# Altium project noname.PrjPcb
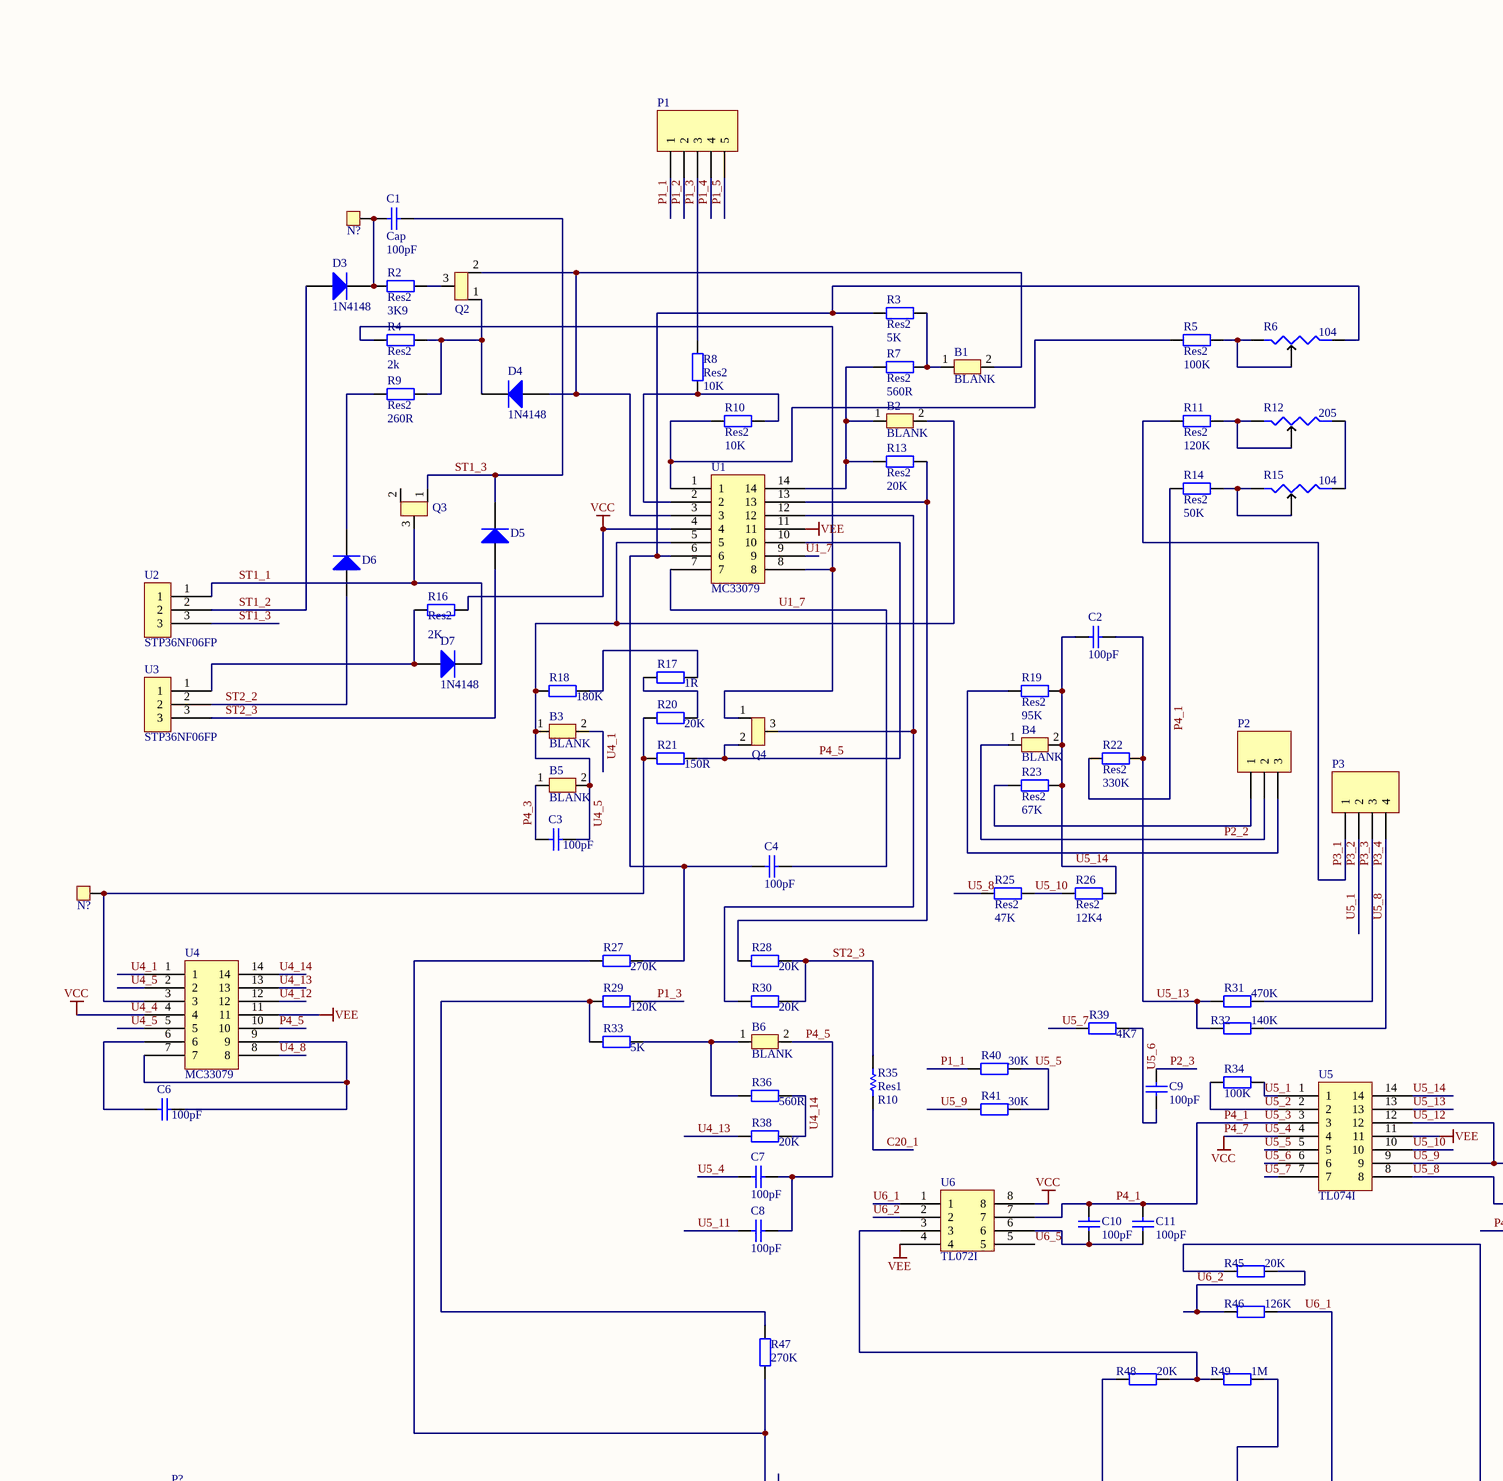
[diagram p0: noname.SchDoc, top left]
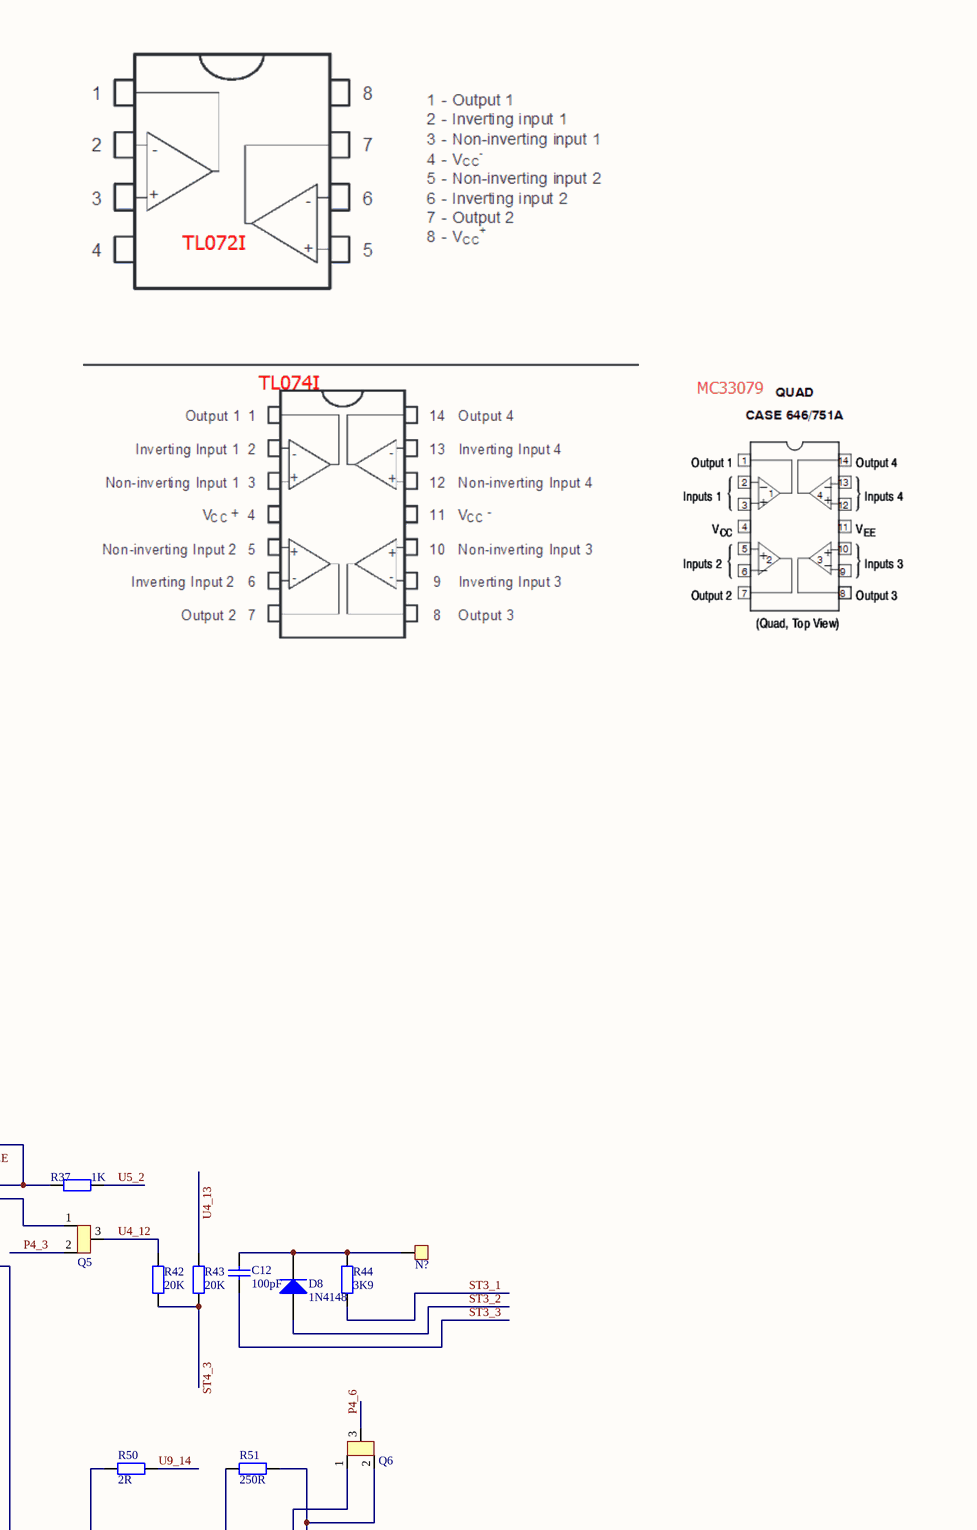
[diagram p1: noname.SchDoc, top right]
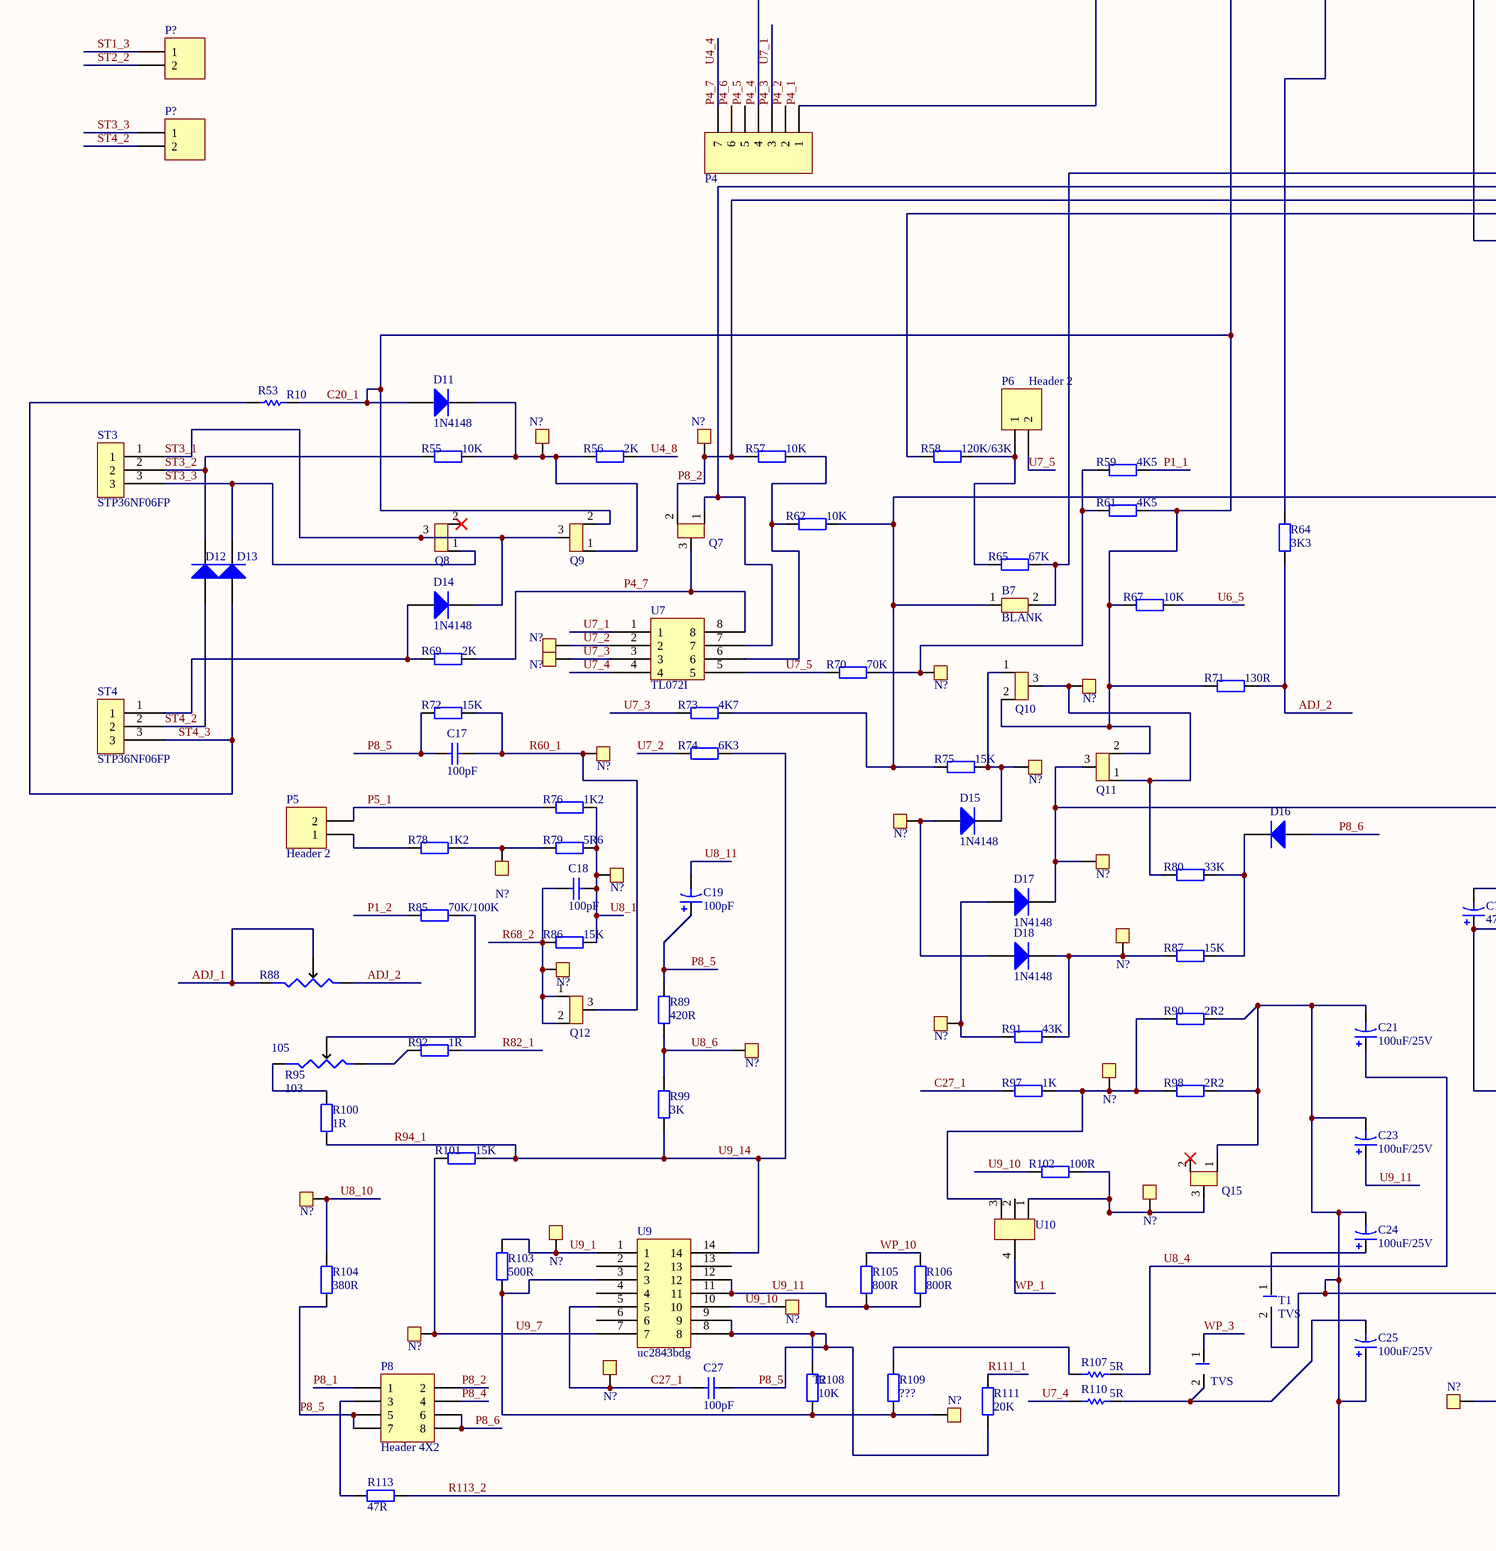
[diagram p2: noname.SchDoc, bottom left]
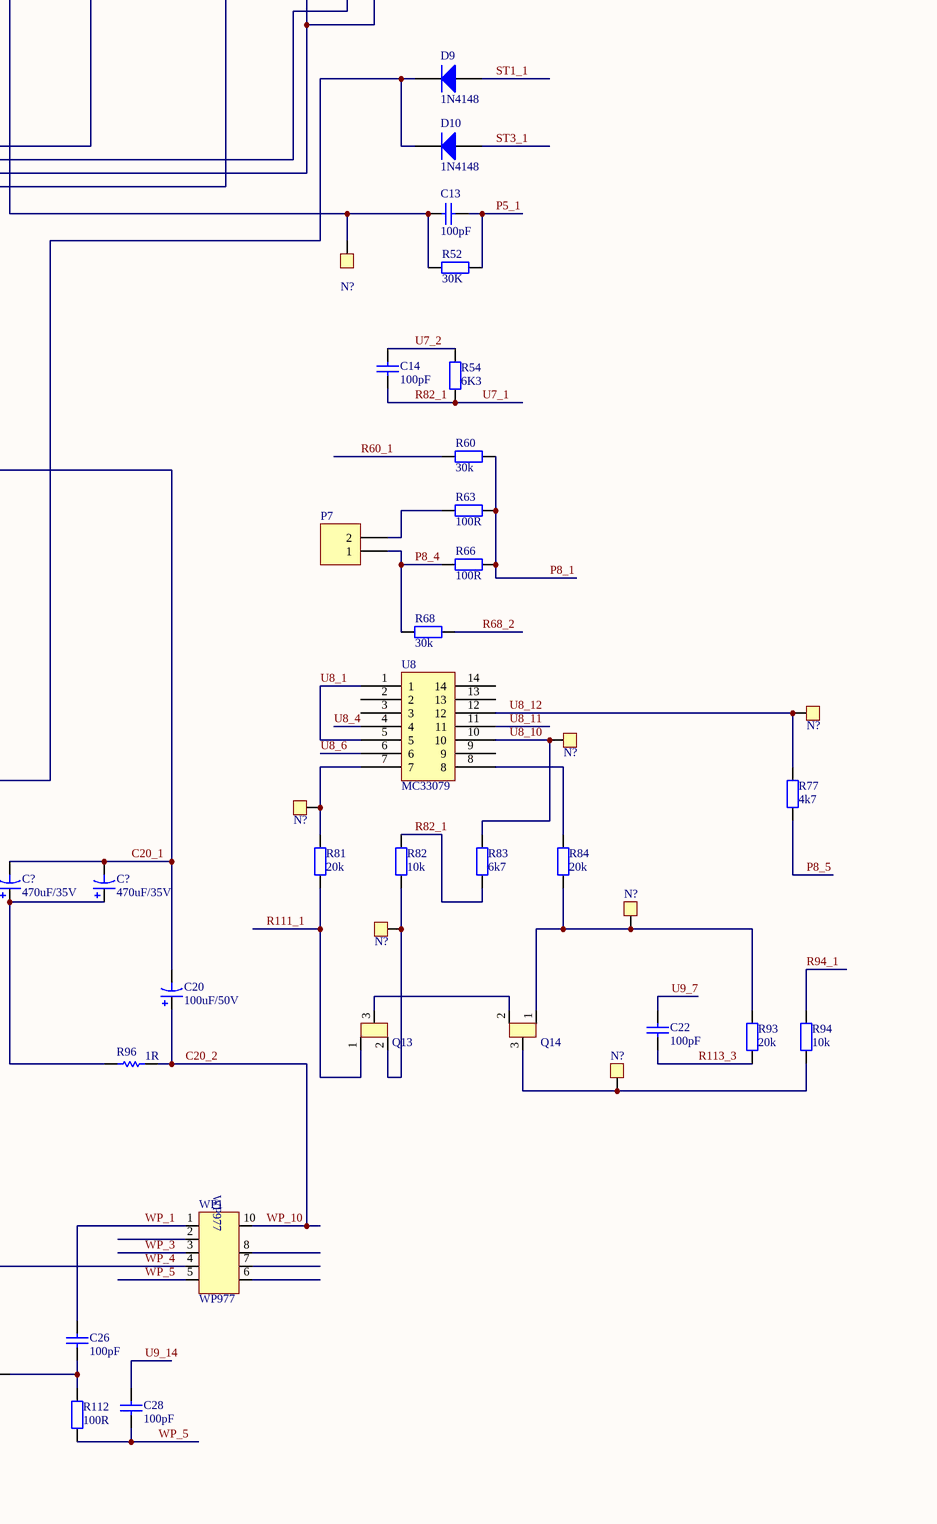
[diagram p3: noname.SchDoc, bottom right]
1 sheet, 235 parts. Net scope: global (net labels, ports and power ports of the same name join across sheets).
Board file: noname.PcbDoc

## Sheet noname.SchDoc
size A0

### Parts
(Parts that share a designator on the sheet are numbered #1, #2 ... from top to bottom, then left to right.)
B1  BLANK  [0805]
B2  BLANK  [0805]
B3  BLANK  [0805]
B4  BLANK  [0805]
B5  BLANK  [0805]
B6  BLANK  [0805]
B7  BLANK  [0805]
C1  Cap  value 100pF  [C0805]
C2  value 100pF  [C0805]  (hidden comment: Cap)
C3  value 100pF  [C0805]  (hidden comment: Cap)
C4  value 100pF  [C0805]  (hidden comment: Cap)
C6  value 100pF  [C0805]  (hidden comment: Cap)
C7  value 100pF  [C0805]  (hidden comment: Cap)
C8  value 100pF  [C0805]  (hidden comment: Cap)
C9  value 100pF  [C0805]  (hidden comment: Cap)
C10  value 100pF  [C0805]  (hidden comment: Cap)
C11  value 100pF  [C0805]  (hidden comment: Cap)
C12  value 100pF  [C0805]  (hidden comment: Cap)
C13  value 100pF  [C0805]  (hidden comment: Cap)
C14  value 100pF  [C0805]  (hidden comment: Cap)
C17  value 100pF  [C0805]  (hidden comment: Cap)
C18  value 100pF  [C0805]  (hidden comment: Cap)
C19  value 100pF  [RB7.6-15]  (hidden comment: Cap Pol1)
C20  value 100uF/50V  [RB7.6-15]  (hidden comment: Cap Pol1)
C21  value 100uF/25V  [RB7.6-15]  (hidden comment: Cap Pol1)
C22  value 100pF  [C0805]  (hidden comment: Cap)
C23  value 100uF/25V  [RB7.6-15]  (hidden comment: Cap Pol1)
C24  value 100uF/25V  [RB7.6-15]  (hidden comment: Cap Pol1)
C25  value 100uF/25V  [RB7.6-15]  (hidden comment: Cap Pol1)
C26  value 100pF  [C0805]  (hidden comment: Cap)
C27  value 100pF  [C0805]  (hidden comment: Cap)
C28  value 100pF  [C0805]  (hidden comment: Cap)
C?#1  value 470uF/35V  [RB7.6-15]  (hidden comment: Cap Pol1)
C?#2  value 470uF/35V  [RB7.6-15]  (hidden comment: Cap Pol1)
D3  1N4148  [0805]
D4  1N4148  [0805]
D5  Diode 1N4001  [DIO10.46-5.3x2.8]  (value not drawn)
D6  Diode 1N4001  [DIO10.46-5.3x2.8]  (value not drawn)
D7  1N4148  [0805]
D8  1N4148  [0805]
D9  1N4148  [0805]
D10  1N4148  [0805]
D11  1N4148  [0805]
D12  Diode 1N4001  [DIO10.46-5.3x2.8]  (value not drawn)
D13  Diode 1N4001  [DIO10.46-5.3x2.8]  (value not drawn)
D14  1N4148  [0805]
D15  1N4148  [0805]
D16  Diode 1N4001  [DIO10.46-5.3x2.8]  (value not drawn)
D17  1N4148  [0805]
D18  1N4148  [0805]
N?#1  Node  (value not drawn)
N?#2  Node  (value not drawn)
N?#3  Node  (value not drawn)
N?#4  Node  (value not drawn)
N?#5  Node  (value not drawn)
N?#6  Node  (value not drawn)
N?#7  Node  (value not drawn)
N?#8  Node  (value not drawn)
N?#9  Node  (value not drawn)
N?#10  Node  (value not drawn)
N?#11  Node  (value not drawn)
N?#12  Node  (value not drawn)
N?#13  Node  (value not drawn)
N?#14  Node  (value not drawn)
N?#15  Node  (value not drawn)
N?#16  Node  (value not drawn)
N?#17  Node  (value not drawn)
N?#18  Node  (value not drawn)
N?#19  Node  (value not drawn)
N?#20  Node  (value not drawn)
N?#21  Node  (value not drawn)
N?#22  Node  (value not drawn)
N?#23  Node  (value not drawn)
N?#24  Node  (value not drawn)
N?#25  Node  (value not drawn)
N?#26  Node  (value not drawn)
N?#27  Node  (value not drawn)
N?#28  Node  (value not drawn)
N?#29  Node  (value not drawn)
N?#30  Node  (value not drawn)
N?#31  Node  (value not drawn)
N?#32  Node  (value not drawn)
N?#33  Node  (value not drawn)
N?#34  Node  (value not drawn)
N?#35  Node  (value not drawn)
P1  Header 5  [HDR1X5]  (value not drawn)
P2  Header 3  [HDR1X3]  (value not drawn)
P3  Header 4  [HDR1X4]  (value not drawn)
P4  Header 7  [HDR1X7]  (value not drawn)
P5  Header 2  [HDR1X2]
P6  Header 2  [HDR1X2]
P7  Header 2  [HDR1X2]  (value not drawn)
P8  Header 4X2  [HDR2X4]
P?#1  Header 2  [HDR1X2]  (value not drawn)
P?#2  Header 2  [HDR1X2]  (value not drawn)
Q2  BC846B  (value not drawn)
Q3  BC846B  (value not drawn)
Q4  BC846B  (value not drawn)
Q5  BC846B  (value not drawn)
Q6  BC846B  (value not drawn)
Q7  BC846B  (value not drawn)
Q8  BC846B  (value not drawn)
Q9  BC846B  (value not drawn)
Q10  BC846B  (value not drawn)
Q11  BC846B  (value not drawn)
Q12  BC846B  (value not drawn)
Q13  BC846B  (value not drawn)
Q14  BC846B  (value not drawn)
Q15  BC846B  (value not drawn)
R2  Res2  value 3K9  [0805]
R3  Res2  value 5K  [0805]
R4  Res2  value 2k  [0805]
R5  Res2  value 100K  [0805]
R6  value 104  [VR3]  (hidden comment: Res Adj)
R7  Res2  value 560R  [0805]
R8  Res2  value 10K  [0805]
R9  Res2  value 260R  [0805]
R10  Res2  value 10K  [0805]
R11  Res2  value 120K  [0805]
R12  value 205  [VR3]  (hidden comment: Res Adj)
R13  Res2  value 20K  [0805]
R14  Res2  value 50K  [0805]
R15  value 104  [VR3]  (hidden comment: Res Adj)
R16  Res2  value 2K  [0805]
R17  value 1R  [0805]  (hidden comment: Res2)
R18  value 180K  [0805]  (hidden comment: Res2)
R19  Res2  value 95K  [0805]
R20  value 20K  [0805]  (hidden comment: Res2)
R21  value 150R  [0805]  (hidden comment: Res2)
R22  Res2  value 330K  [0805]
R23  Res2  value 67K  [0805]
R25  Res2  value 47K  [0805]
R26  Res2  value 12K4  [0805]
R27  value 270K  [0805]  (hidden comment: Res2)
R28  value 20K  [0805]  (hidden comment: Res2)
R29  value 120K  [0805]  (hidden comment: Res2)
R30  value 20K  [0805]  (hidden comment: Res2)
R31  value 470K  [0805]  (hidden comment: Res2)
R32  value 140K  [0805]  (hidden comment: Res2)
R33  value 5K  [0805]  (hidden comment: Res2)
R34  value 100K  [0805]  (hidden comment: Res2)
R35  Res1  value R10  [AXIAL-0.3]
R36  value 560R  [0805]  (hidden comment: Res2)
R37  value 1K  [0805]  (hidden comment: Res2)
R38  value 20K  [0805]  (hidden comment: Res2)
R39  value 4K7  [0805]  (hidden comment: Res2)
R40  value 30K  [0805]  (hidden comment: Res2)
R41  value 30K  [0805]  (hidden comment: Res2)
R42  value 20K  [0805]  (hidden comment: Res2)
R43  value 20K  [0805]  (hidden comment: Res2)
R44  value 3K9  [0805]  (hidden comment: Res2)
R45  value 20K  [0805]  (hidden comment: Res2)
R46  value 126K  [0805]  (hidden comment: Res2)
R47  value 270K  [0805]  (hidden comment: Res2)
R48  value 20K  [0805]  (hidden comment: Res2)
R49  value 1M  [0805]  (hidden comment: Res2)
R50  value 2R  [0805]  (hidden comment: Res2)
R51  value 250R  [0805]  (hidden comment: Res2)
R52  value 30K  [0805]  (hidden comment: Res2)
R53  value R10  [AXIAL-0.3]  (hidden comment: Res1)
R54  value 6K3  [0805]  (hidden comment: Res2)
R55  value 10K  [0805]  (hidden comment: Res2)
R56  value 2K  [0805]  (hidden comment: Res2)
R57  value 10K  [0805]  (hidden comment: Res2)
R58  value 120K/63K  [0805]  (hidden comment: Res2)
R59  value 4K5  [0805]  (hidden comment: Res2)
R60  value 30k  [0805]  (hidden comment: Res2)
R61  value 4K5  [0805]  (hidden comment: Res2)
R62  value 10K  [0805]  (hidden comment: Res2)
R63  value 100R  [0805]  (hidden comment: Res2)
R64  value 3K3  [0805]  (hidden comment: Res2)
R65  value 67K  [0805]  (hidden comment: Res2)
R66  value 100R  [0805]  (hidden comment: Res2)
R67  value 10K  [0805]  (hidden comment: Res2)
R68  value 30k  [0805]  (hidden comment: Res2)
R69  value 2K  [0805]  (hidden comment: Res2)
R70  value 70K  [0805]  (hidden comment: Res2)
R71  value 130R  [0805]  (hidden comment: Res2)
R72  value 15K  [0805]  (hidden comment: Res2)
R73  value 4K7  [0805]  (hidden comment: Res2)
R74  value 6K3  [0805]  (hidden comment: Res2)
R75  value 15K  [0805]  (hidden comment: Res2)
R76  value 1K2  [0805]  (hidden comment: Res2)
R77  value 4k7  [0805]  (hidden comment: Res2)
R78  value 1K2  [0805]  (hidden comment: Res2)
R79  value 5R6  [0805]  (hidden comment: Res2)
R80  value 33K  [0805]  (hidden comment: Res2)
R81  value 20k  [0805]  (hidden comment: Res2)
R82  value 10k  [0805]  (hidden comment: Res2)
R83  value 6k7  [0805]  (hidden comment: Res2)
R84  value 20k  [0805]  (hidden comment: Res2)
R85  value 70K/100K  [0805]  (hidden comment: Res2)
R86  value 15K  [0805]  (hidden comment: Res2)
R87  value 15K  [0805]  (hidden comment: Res2)
R88  value 105  [VR3]  (hidden comment: Res Adj)
R89  value 420R  [0805]  (hidden comment: Res2)
R90  value 2R2  [0805]  (hidden comment: Res2)
R91  value 43K  [0805]  (hidden comment: Res2)
R92  value 1R  [0805]  (hidden comment: Res2)
R93  value 20k  [0805]  (hidden comment: Res2)
R94  value 10k  [0805]  (hidden comment: Res2)
R95  value 103  [VR3]  (hidden comment: Res Adj)
R96  value 1R  [0805]  (hidden comment: Res1)
R97  value 1K  [0805]  (hidden comment: Res2)
R98  value 2R2  [0805]  (hidden comment: Res2)
R99  value 3K  [0805]  (hidden comment: Res2)
R100  value 1R  [0805]  (hidden comment: Res2)
R101  value 15K  [0805]  (hidden comment: Res2)
R102  value 100R  [0805]  (hidden comment: Res2)
R103  value 500R  [0805]  (hidden comment: Res2)
R104  value 380R  [0805]  (hidden comment: Res2)
R105  value 800R  [0805]  (hidden comment: Res2)
R106  value 800R  [0805]  (hidden comment: Res2)
R107  value 5R  [0805]  (hidden comment: Res1)
R108  value 10K  [0805]  (hidden comment: Res2)
R109  value ???  [0805]  (hidden comment: Res2)
R110  value 5R  [0805]  (hidden comment: Res1)
R111  value 20K  [0805]  (hidden comment: Res2)
R112  value 100R  [0805]  (hidden comment: Res2)
R113  value 47R  [0805]  (hidden comment: Res2)
ST3  STP36NF06FP
ST4  STP36NF06FP
T1  TVS
T2  TVS
U1  MC33079  [SOIC14_N]
U2  STP36NF06FP
U3  STP36NF06FP
U4  MC33079  [SOIC14_N]
U5  TL074I  [SOIC14_N]
U6  TL072I  [SOIC8_L]
U7  TL072I  [SOIC8_L]
U8  MC33079  [SOIC14_N]
U9  uc2843bdg  [SOIC14]
U10  bsp296  (value not drawn)
WP1  WP977

### Nets
P4_7: C7.2 P4.7 Q7.3 R16.2 R69.2 U1.4 U4.4 U5.4 U6.8 U7.8  [also labelled U4_4, U5_4, VCC]
VEE: U1.11 U4.11 U5.11 U6.4
ADJ_1: R88.2(TAP) R88.3(B)
ADJ_2: R64.1 R71.2 R88.1(A)
C20_1: B7.1 C20.2 C?#1.2 C?#2.2 D11.1(A) Q9.2 Q10.2 Q11.2 R35.1 R49.2 R53.1 R61.2 R62.2 R67.1 R71.1 R73.2 R75.1
C20_2: C20.1 R96.1 R105.2 R106.2 WP1.10  [also labelled WP_10]
C27_1: C27.2 N?#34.1 R97.1 U9.5
P1_1: P1.1 R40.1 R59.2
P1_2: P1.2 R85.1
P1_3: P1.3 R8.2 R29.2
P1_4: P1.4
P1_5: P1.5
P2_2: B4.1 P2.2
P2_3: C9.1
P3_1: P3.1 R11.1
P3_2: P3.2 R34.1 U5.1  [also labelled U5_1]
P3_3: P3.3 R31.2
P3_4: P3.4 Q5.1 R25.1 R32.2 U5.8  [also labelled U5_8]
P4_1: C10.1 C11.1 P4.1 R14.1 R22.1 R48.1 U5.3 U6.7  [also labelled U5_3]
P4_2: P4.2
P4_3: B5.1 C3.1 C14.1 P4.3 Q5.2 R54.2 R82.2 R83.1 R92.2 U7.1  [also labelled R82_1, U7_1]
P4_4: P4.4 R27.1 R47.1
P4_5: B6.2 C7.1 C8.1 P4.5 Q4.2 R21.2 U1.10 U4.10
P4_6: P4.6 Q6.3
P5_1: C13.2 P5.2 R52.1 R76.1
P8_1: P8.1 R60.2 R63.2 R66.2
P8_2: N?#6.1 P8.2 Q6.2 Q7.2 R51.2 R57.1
P8_4: P7.1 P8.4 R66.1 R68.1
P8_5: C17.2 C19.1 C27.1 P8.5 P8.7 R72.1 R77.1 R89.2 R104.1 R108.2 R111.1 U9.8 U9.9
P8_6: D16.1(A) P8.6 P8.8
R60_1: C17.1 N?#12.1 Q12.3 R60.1 R72.2
R68_2: C18.2 N?#23.1 Q12.1 Q12.2 R68.2 R86.1
R94_1: C28.1 R50.2 R74.2 R94.2 R99.1 R100.1 R101.2 U9.14  [also labelled U9_14]
R111_1: Q13.1 R81.1 R111.2
R113_2: C21.2 C23.2 C24.2 C25.1 Q15.1 R90.2 R98.2 R113.1 T1.2 WP1.4  [also labelled WP_4]
R113_3: C22.2 R93.1
ST1_1: D7.2(K) D9.1(A) Q3.3 U2.1
ST1_2: D3.1(A) U2.2
ST1_3: C1.1 D5.2(K) P?#1.1 Q3.1 U2.3
ST2_2: D6.1(A) P?#1.2 U3.2
ST2_3: D5.1(A) R28.2 R30.2 R35.2 U3.3
ST3_1: D10.1(A) D14.2(K) Q8.3 Q9.3 R44.1 ST3.1
ST3_2: D8.1(A) D12.2(K) R55.1 ST3.2
ST3_3: C12.2 D13.2(K) P?#2.1 Q8.1 ST3.3
ST4_2: D12.1(A) P?#2.2 ST4.2
ST4_3: D13.1(A) R42.1 R43.1 R53.2 ST4.3
U1_7: C4.1 U1.7 U1.9
U4_1: B3.2 U4.1
U4_5: B2.2 B3.1 B5.2 C3.2 R18.1 U1.5 U4.2 U4.5
U4_8: R56.2 U4.8
U4_12: Q5.3 R42.2 U4.12
U4_13: R38.1 R43.2 U4.13
U4_14: R36.2 R38.2 U4.14
U5_2: R34.2 R37.2 U5.2
U5_5: R40.2 R41.2 U5.5
U5_6: C9.2 R39.2 U5.6
U5_7: R39.1 U5.7
U5_10: R25.2 R26.1 U5.10
U5_11: C8.2
U5_12: R37.1 R41.1 U5.9 U5.12  [also labelled U5_9]
U5_13: C2.1 R22.2 R31.1 R32.1 U5.13
U5_14: B4.2 C2.2 R19.2 R23.2 R26.2 U5.14
U6_1: R46.2 R64.2 U6.1
U6_2: R45.2 R46.1 U6.2
U6_5: R67.2 U6.5
U7_2: C14.2 N?#7.1 R54.1 R74.1 U7.2
U7_3: N?#8.1 R73.1 U7.3
U7_4: R110.2 U7.4
U7_5: P6.2 R70.1 U7.5
U8_1: C18.1 N?#19.1 R76.2 R79.2 R86.2 U8.1 U8.5
U8_4: C21.1 R107.1 U8.4
U8_6: N?#25.1 R89.1 R99.2 U8.6
U8_10: N?#14.1 N?#28.1 R83.2 R104.2 U8.10
U8_11: C19.2 U8.11
U8_12: N?#11.1 R77.2 U8.12
U9_1: N?#30.1 R103.2 U9.1
U9_7: C22.1 N?#32.1 R101.1 U9.7
U9_10: N?#31.1 R102.1 U9.10
U9_11: C23.1 R105.1 R106.1 U9.11 U9.12
WP_1: C26.1 U10.4 WP1.1
WP_3: T2.1 WP1.3
WP_5: C28.2 R112.1 WP1.5
NetB1_1: B1.1 R3.2 R7.2
NetB1_2: B1.2 D4.1(A) Q2.2 U1.3
NetB2_1: B2.1 R7.1 R13.1 U1.14
NetB6_1: B6.1 R33.2 R36.1
NetB7_2: B7.2 R50.1 R65.2
NetC1_2: C1.2 D3.2(K) N?#1.1 R2.2
NetC4_2: C4.2 R3.1 R6.3(B) R27.2 U1.6
NetC6_1: C6.1 U4.6
NetC6_2: C6.2 U4.7 U4.9
NetC10_2: C10.2 C11.2 U6.6
NetC12_1: C12.1 D8.2(K) N?#3.1 R44.2
NetC13_1: C13.1 N?#4.1 R45.1 R52.2
NetC24_1: C24.1 T1.1
NetC25_2: C25.2 R110.1 T2.2
NetC26_2: C26.2 N?#33.1 R112.2
NetC?#1_1: C?#1.1 C?#2.1 R96.2
NetD4_2: D4.2(K) Q2.1 R4.2 R9.2
NetD6_2: D6.2(K) R9.1
NetD7_1: D7.1(A) R16.1 U3.1
NetD9_2: D9.2(K) D10.2(K) D17.2(K) N?#18.1 Q11.3
NetD11_2: D11.2(K) N?#5.1 Q9.1 R55.2 R56.1
NetD14_1: D14.1(A) R69.1 ST4.1
NetD15_1: D15.1(A) D18.1(A) N?#15.1
NetD15_2: D15.2(K) N?#13.1 Q10.1 R75.2
NetD16_2: D16.2(K) R80.2 R87.2
NetD17_1: D17.1(A) N?#24.1 R91.1
NetD18_2: D18.2(K) N?#21.1 R87.1 R91.2
NetN?#2_1: N?#2.1 R20.1 R21.1 U4.3
NetN?#9_1: N?#9.1 R59.1 R61.1 R70.2
NetN?#10_1: N?#10.1 Q10.3 Q11.1 R80.1
NetN?#16_1: N?#16.1 R81.2 U8.7
NetN?#17_1: N?#17.1 R78.2 R79.1
NetN?#20_1: N?#20.1 Q13.2 R82.1
NetN?#22_1: N?#22.1 Q14.1 R84.1 R93.2
NetN?#26_1: N?#26.1 R90.1 R97.2 R98.1 U10.3
NetN?#27_1: N?#27.1 Q14.3 R94.1
NetN?#29_1: N?#29.1 Q15.3 R102.2 U10.1
NetN?#35_1: N?#35.1 R103.1 R108.1 R109.1 U9.3
NetP2_1: P2.1 R23.1
NetP2_3: P2.3 R19.1
NetP5_1: P5.1 R78.1
NetP6_1: P6.1 R58.2 R65.1
NetP7_2: P7.2 R63.1
NetP8_3: P8.3 R113.2
NetQ2_3: Q2.3 R2.1
NetQ4_1: Q4.1 R4.1 U1.8
NetQ4_3: Q4.3 R30.1 U1.12
NetQ6_1: Q6.1 Q7.1 U7.7
NetQ13_3: Q13.3 Q14.2
NetR5_1: R5.1 R10.1 U1.1
NetR5_2: R5.2 R6.1(A) R6.2(TAP)
NetR8_1: R8.1 R10.2 U1.2
NetR11_2: R11.2 R12.1(A) R12.2(TAP)
NetR12_3: R12.3(B) R15.3(B)
NetR13_2: R13.2 R28.1 U1.13
NetR14_2: R14.2 R15.1(A) R15.2(TAP)
NetR17_1: R17.1 R20.2
NetR17_2: R17.2 R18.2
NetR29_1: R29.1 R33.1 R47.2
NetR48_2: R48.2 R49.1 U6.3
NetR51_1: R51.1 R58.1
NetR57_2: R57.2 R62.1 U7.6
NetR84_2: R84.2 U8.8
NetR85_2: R85.2 R95.2(TAP)
NetR92_1: R92.1 R95.1(A)
NetR95_3: R95.3(B) R100.2
NetR107_2: R107.2 R109.2

Not connected (* = marked no-connect by the designer): Q3 2; Q8 2*; Q15 2*; U8 2 3 9 13 14; U9 2 4 6 13; U10 2; WP1 2 6 7 8

### Library data of the parts
C1-C4 C6-C14 C17 C18 C22 C26-C28 = Cap: Capacitor; Published: 8-Jun-2000; LatestRevisionDate: 17-Jul-2002; LatestRevisionNote: Re-released for DXP Platform.; PackageReference: RAD-0.3; Publisher: Altium Limited
C19-C21 C23-C25 C?#1 C?#2 = Cap Pol1: Polarized Capacitor (Radial); Published: 8-Jun-2000; LatestRevisionDate: 17-Jul-2002; LatestRevisionNote: Re-released for DXP Platform.; PackageReference: RB7.6-15; Publisher: Altium Limited
D3 D4 D7-D11 D14 D15 D17 D18 = 1N4148: High Conductance Fast Diode; Published: 8-Jun-2000; LatestRevisionDate: 17-Jul-2002; LatestRevisionNote: Re-released for DXP Platform.; DatasheetDocument: 1997; PackageReference: DO-35; Publisher: Altium Limited; Code_JEDEC: DO-204-AH; ComponentLink1Description: Manufacturer Link; ComponentLink1URL: http://www.fairchildsemi.com/; ComponentLink2Description: Datasheet; ComponentLink2URL: http://www.fairchildsemi.com/ds/1N%2F1N4148.pdf
D5 D6 D12 D13 D16 = Diode 1N4001: 1 Amp General Purpose Rectifier; Published: 8-Jun-2000; LatestRevisionDate: 17-Jul-2002; LatestRevisionNote: Re-released for DXP Platform.; DatasheetVersion: 1998; PackageVersion: Aug-1999; PackageReference: DO-41; Publisher: Altium Limited; Code_JEDEC: DO-204-AL; ComponentLink1Description: Manufacturer Link; ComponentLink1URL: http://www.fairchildsemi.com/; ComponentLink2Description: Datasheet; ComponentLink2URL: http://www.fairchildsemi.com/ds/1N%2F1N4001.pdf
P1 = Header 5: Header, 5-Pin; LatestRevisionDate: 17-Jul-2002; LatestRevisionNote: Re-released for DXP Platform.; Publisher: Altium Limited
P2 = Header 3: Header, 3-Pin; LatestRevisionDate: 17-Jul-2002; LatestRevisionNote: Re-released for DXP Platform.; Publisher: Altium Limited
P3 = Header 4: Header, 4-Pin; LatestRevisionDate: 17-Jul-2002; LatestRevisionNote: Re-released for DXP Platform.; Publisher: Altium Limited
P4 = Header 7: Header, 7-Pin; LatestRevisionDate: 17-Jul-2002; LatestRevisionNote: Re-released for DXP Platform.; Publisher: Altium Limited
P5-P7 P?#1 P?#2 = Header 2: Header, 2-Pin; LatestRevisionDate: 17-Jul-2002; LatestRevisionNote: Re-released for DXP Platform.; Publisher: Altium Limited
P8 = Header 4X2: Header, 4-Pin, Dual row; LatestRevisionDate: 17-Jul-2002; LatestRevisionNote: Re-released for DXP Platform.; Publisher: Altium Limited
R2-R5 R7-R11 R13 R14 R16-R23 R25-R34 R36-R52 R54-R87 R89-R94 R97-R106 R108 R109 R111-R113 = Res2: Resistor; Published: 8-Jun-2000; LatestRevisionDate: 17-Jul-2002; LatestRevisionNote: Re-released for DXP Platform.; PackageReference: AXIAL-0.4; Publisher: Altium Limited
R6 R12 R15 R88 R95 = Res Adj: Tapped Resistor; Sim Note: Enter the Resistance value and the set point into parameter fields.; Set Position: 0.5; Published: 24-Mar-1999; LatestRevisionDate: 17-Jul-2002; LatestRevisionNote: Re-released for DXP Platform.; PackageReference: VR3; Publisher: Altium Limited
R35 R53 R96 R107 R110 = Res1: Resistor; Published: 8-Jun-2000; LatestRevisionDate: 17-Jul-2002; LatestRevisionNote: Re-released for DXP Platform.; PackageReference: AXIAL-0.3; Publisher: Altium Limited